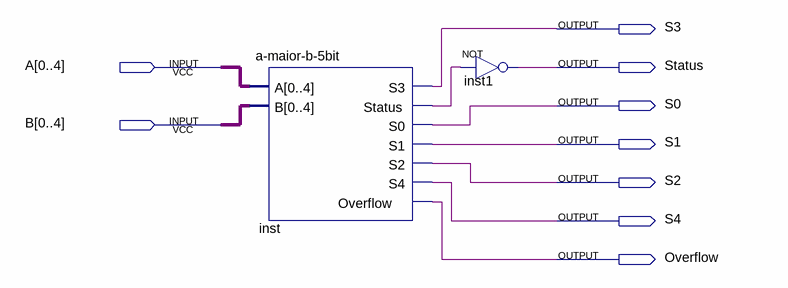
[diagram p0: schematic sheet]
// Quartus schematic a-menor-igual-b-5bit.bdf as structural Verilog: 2 symbols, 9 pins
module \a-menor-igual-b-5bit  (
  input  [0:4] A,
  input  [0:4] B,
  output S3,
  output Status,
  output S0,
  output S1,
  output S2,
  output S4,
  output Overflow
);

  wire inst_status;

  \a-maior-b-5bit  inst (
    .A(A), .B(B), .S3(S3), .Status(inst_status), .S0(S0), .S1(S1), .S2(S2), .S4(S4), .Overflow(Overflow));
  not inst1 (Status, inst_status);
endmodule
